# EAGLE design CR Weather (EAGLE 9.6.2)
CNAME: CR Weather Station; CREVISION: 0.1; DESIGNER: crundberg
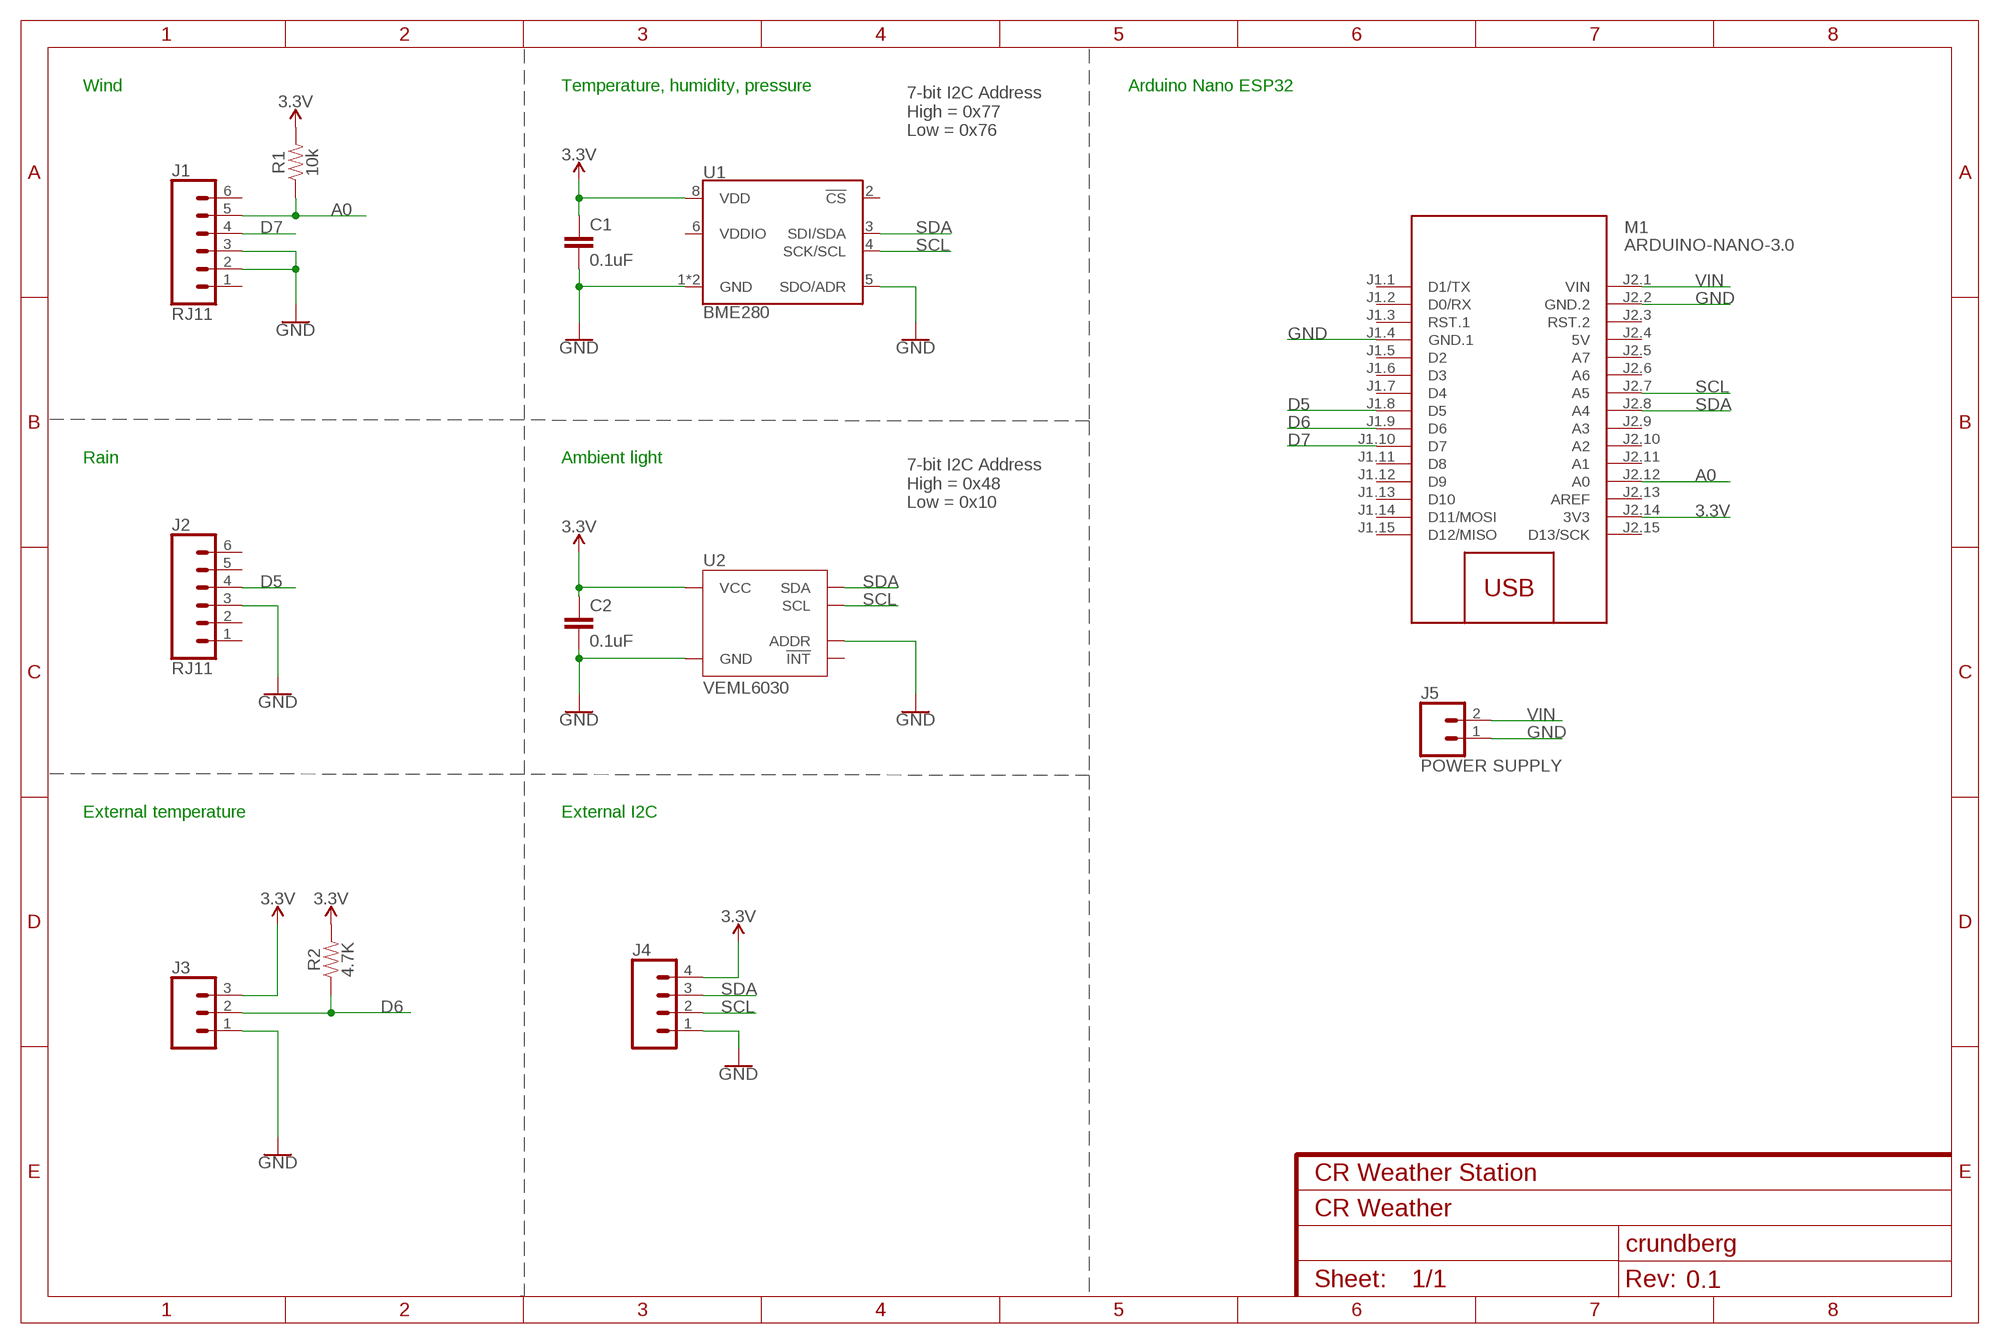
[diagram p0: schematic, sheet 1]

## Parts
C1  0.1uF  0.1UF-0402-6.3V-10%-X7R  [0402]
C2  0.1uF  0.1UF-0402-6.3V-10%-X7R  [0402]
J1  RJ11  RJ11-6  [RJ11-6]
J2  RJ11  RJ11-6  [RJ11-6]
J3  CONN_03SCREW  [SCREWTERMINAL-3.5MM-3]
J4  CONN_04SCREW  [SCREWTERMINAL-3.5MM-4]
J5  POWER SUPPLY  CONN_023.5MM  [SCREWTERMINAL-3.5MM-2]
M1  ARDUINO-NANO-3.0  [ARDUINO-NANO-3.0]
R1  10k  RESISTOR1206  [1206]
R2  4.7K  RESISTOR1206  [1206]
U1  BME280  [LGA-8-2.5X2.5]
U2  VEML6030  [VEML6030]

## Nets
3.3V: C1.1 C2.1 J3.3 J4.4 M1.J2.14(3V3) R1.2 R2.2 U1.8(VDD) U2.6(VCC)
A0: J1.5 M1.J2.12(A0) R1.1
D5: J2.4 M1.J1.8(D5)
D6: J3.2 M1.J1.9(D6) R2.1
D7: J1.4 M1.J1.10(D7)
GND: C1.2 C2.2 J1.2 J1.3 J2.3 J3.1 J4.1 J5.1 M1.J1.4(GND.1) M1.J2.2(GND.2) U1.1(GND) U1.5(SDO/ADR) U1.7(GND) U2.1(GND) U2.4(ADDR)
SCL: J4.2 M1.J2.7(A5) U1.4(SCK/SCL) U2.5(SCL)
SDA: J4.3 M1.J2.8(A4) U1.3(SDI/SDA) U2.2(SDA)
VIN: J5.2 M1.J2.1(VIN)
Unconnected: J1.1 J1.6 J2.1 J2.2 J2.5 J2.6 M1.J1.1(D1/TX) M1.J1.2(D0/RX) M1.J1.3(RST.1) M1.J1.5(D2) M1.J1.6(D3) M1.J1.7(D4) M1.J1.11(D8) M1.J1.12(D9) M1.J1.13(D10) M1.J1.14(D11/MOSI) M1.J1.15(D12/MISO) M1.J2.3(RST.2) M1.J2.5(A7) M1.J2.6(A6) M1.J2.9(A3) M1.J2.10(A2) M1.J2.11(A1) M1.J2.13(AREF) M1.J2.15(D13/SCK) U1.2(!CS) U1.6(VDDIO) U2.3(!INT)

## Notes on the sheet
- Wind | Temperature, humidity, pressure | Arduino Nano ESP32
- 7-bit I2C Address
  High = 0x77
  Low = 0x76
- Rain | Ambient light
- 7-bit I2C Address
  High = 0x48
  Low = 0x10
- External temperature | External I2C

## Power pins joined to a net without a drawn wire
5V: M1.J2.4(5V)

## Library data of the parts
C1 C2 = SparkFun-Capacitors:0.1UF: 0.1µF ceramic capacitors A capacitor is a passive two-terminal electrical component used to store electrical energy temporarily in an electric field.; PROD_ID: CAP-14993
J1 J2 = SparkFun-Connectors:RJ11-6: RJ11 Jack - 6 pin Commonly found on CAT3 devices and some Microchip programmers. Here is the connector we sell at SparkFun: RJ11 6-Pin Connector <https://www.sparkfun.com/products/132> (PRT-00132) Datasheet <http://www.sparkfun.com/datasheets/Prototyping/Connectors/RJ11-Datasheet.pdf> It is used on this SparkFun product: SparkFun Weather Shield <https://www.sparkfun.com/products/12081> (DEV-12081) Weather Meters <https://www.sparkfun.com/products/8942> (SEN-08942); PROD_ID: CONN-08590; SF_ID: PRT-00132
J3 = SparkFun-Connectors:CONN_03: Multi connection point. Often used as Generic Header-pin footprint for 0.1 inch spaced/style header connections On any of the 0.1 inch spaced packages, you can populate with these: Break Away Headers - Straight <https://www.sparkfun.com/products/116> (PRT-00116) Break Away Male Headers - Right Angle <https://www.sparkfun.com/products/553> (PRT-00553) Female Headers <https://www.sparkfun.com/products/115> (PRT-00115) Break Away Headers - Machine Pin <https://www.sparkfun.com/products/117> (PRT-00117) Break Away Female Headers - Swiss Machine Pin <https://www.sparkfun.com/products/743> (PRT-00743) Stackable Header - 3 Pin (Female, 0.1") <https://www.sparkfun.com/products/13875> (PRT-13875) For SCREWTERMINALS and SPRING TERMINALS visit here: Screw Terimnals on SparkFun.com <https://www.sparkfun.com/search/results?term=Screw+Terminals> (5mm/3.5mm/2.54mm spacing) This device is also useful as a general connection point to wire up your design to another part of your project. Our various solder wires solder well into these plated through hole pads. Hook-Up Wire - Assortment (Stranded, 22 AWG) <https://www.sparkfun.com/products/11375> (PRT-11375) Hook-Up Wire - Assortment (Solid Core, 22 AWG) <https://www.sparkfun.com/products/11367> (PRT-11367) View the entire wire category on our website here <https://www.sparkfun.com/categories/141> Special notes: Molex polarized connector foot print use with SKU : PRT-08232 with associated crimp pins and housings.; PROD_ID: CONN-08288; SF_ID: PRT-08235
J4 = SparkFun-Connectors:CONN_04: Multi connection point. Often used as Generic Header-pin footprint for 0.1 inch spaced/style header connections On any of the 0.1 inch spaced packages, you can populate with these: Break Away Headers - Straight <https://www.sparkfun.com/products/116> (PRT-00116) Break Away Male Headers - Right Angle <https://www.sparkfun.com/products/553> (PRT-00553) Female Headers <https://www.sparkfun.com/products/115> (PRT-00115) Break Away Headers - Machine Pin <https://www.sparkfun.com/products/117> (PRT-00117) Break Away Female Headers - Swiss Machine Pin <https://www.sparkfun.com/products/743> (PRT-00743) For SCREWTERMINALS and SPRING TERMINALS visit here: Screw Terimnals on SparkFun.com <https://www.sparkfun.com/search/results?term=Screw+Terminals> (5mm/3.5mm/2.54mm spacing) This device is also useful as a general connection point to wire up your design to another part of your project. Our various solder wires solder well into these plated through hole pads. Hook-Up Wire - Assortment (Stranded, 22 AWG) <https://www.sparkfun.com/products/11375> (PRT-11375) Hook-Up Wire - Assortment (Solid Core, 22 AWG) <https://www.sparkfun.com/products/11367> (PRT-11367) View the entire wire category on our website here <https://www.sparkfun.com/categories/141> Special notes: Molex polarized connector foot print use with SKU : PRT-08231 with associated crimp pins and housings. 1MM SMD Version SKU: PRT-10208; PROD_ID: CONN-14485
J5 = SparkFun-Connectors:CONN_02: Multi connection point. Often used as Generic Header-pin footprint for 0.1 inch spaced/style header connections On any of the 0.1 inch spaced packages, you can populate with these: Break Away Headers - Straight <https://www.sparkfun.com/products/116> (PRT-00116) Break Away Male Headers - Right Angle <https://www.sparkfun.com/products/553> (PRT-00553) Female Headers <https://www.sparkfun.com/products/115> (PRT-00115) Break Away Headers - Machine Pin <https://www.sparkfun.com/products/117> (PRT-00117) Break Away Female Headers - Swiss Machine Pin <https://www.sparkfun.com/products/743> (PRT-00743) For SCREWTERMINALS and SPRING TERMINALS visit here: Screw Terimnals on SparkFun.com <https://www.sparkfun.com/search/results?term=Screw+Terminals> (5mm/3.5mm/2.54mm spacing) This device is also useful as a general connection point to wire up your design to another part of your project. Our various solder wires solder well into these plated through hole pads. Hook-Up Wire - Assortment (Stranded, 22 AWG) <https://www.sparkfun.com/products/11375> (PRT-11375) Hook-Up Wire - Assortment (Solid Core, 22 AWG) <https://www.sparkfun.com/products/11367> (PRT-11367) View the entire wire category on our website here <https://www.sparkfun.com/categories/141> Special notes: Molex polarized connector foot print use with: PRT-08233 with associated crimp pins and housings. 2.54_SCREWTERM for use with PRT-10571. 3.5mm Screw Terminal footprints for PRT-08084 5mm Screw Terminal footprints for use with PRT-08432; PROD_ID: CONN-08399
M1 = diy-modules:ARDUINO-NANO-3.0: Arduino Nano 3.0 and compatible devices More details available here: https://www.arduino.cc/en/Main/ArduinoBoardNano Click here to find device on ebay.com <http://www.ebay.com/sch/arduino+nano>
R1 R2 = SparkFun-Resistors:RESISTOR: Generic Resistor Package
U1 = SparkFun-Sensors:BME280: Bosch BME280 – Combined Humidity and Pressure Sensor The BME280 is as combined digital humidity, pressure and temperature sensor based on proven sensing principles. The sensor module is housed in an extremely compact metal-lid LGA package with a footprint of only 2.5×2.5mm² with a height of 0.93mm. Its small dimensions and its low power consumption allow the implementation in battery driven devices such as handsets, GPS modules or watches. Datasheet <https://cdn.sparkfun.com/assets/learn_tutorials/4/1/9/BST-BME280_DS001-10.pdf> SparkFun Products SparkFun Atmospheric Sensor Breakout - BME280 <https://www.sparkfun.com/products/13676> (SEN-13676); PROD_ID: IC-13090
U2 = SparkFun-Sensors:VEML6030: VEML6030 Ambient Light Sensor VEML6030 is a high accuracy ambient light digital 16-bit resolution sensor in a miniature transparent 2 mm x 2 mm package. It includes a high sensitive photodiode, a low noise amplifier, a 16-bit A/D converter and supports an easy to use I2C bus communication interface and additional interrupt feature.; PROD_ID: IC-14447

## Board
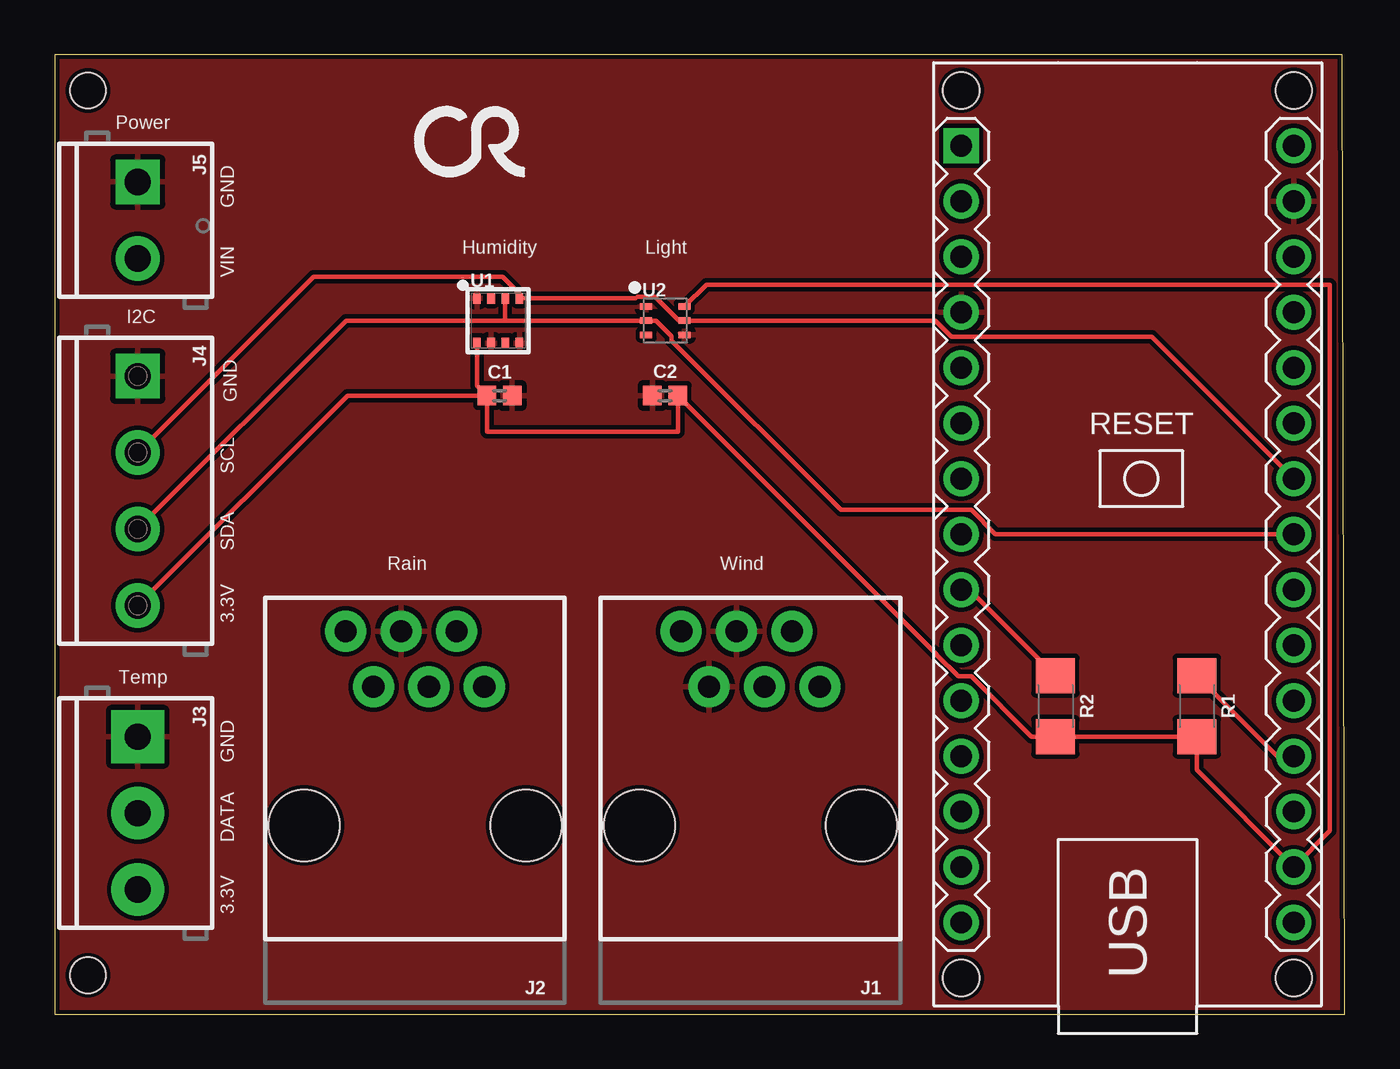
[diagram p1: board, top side]
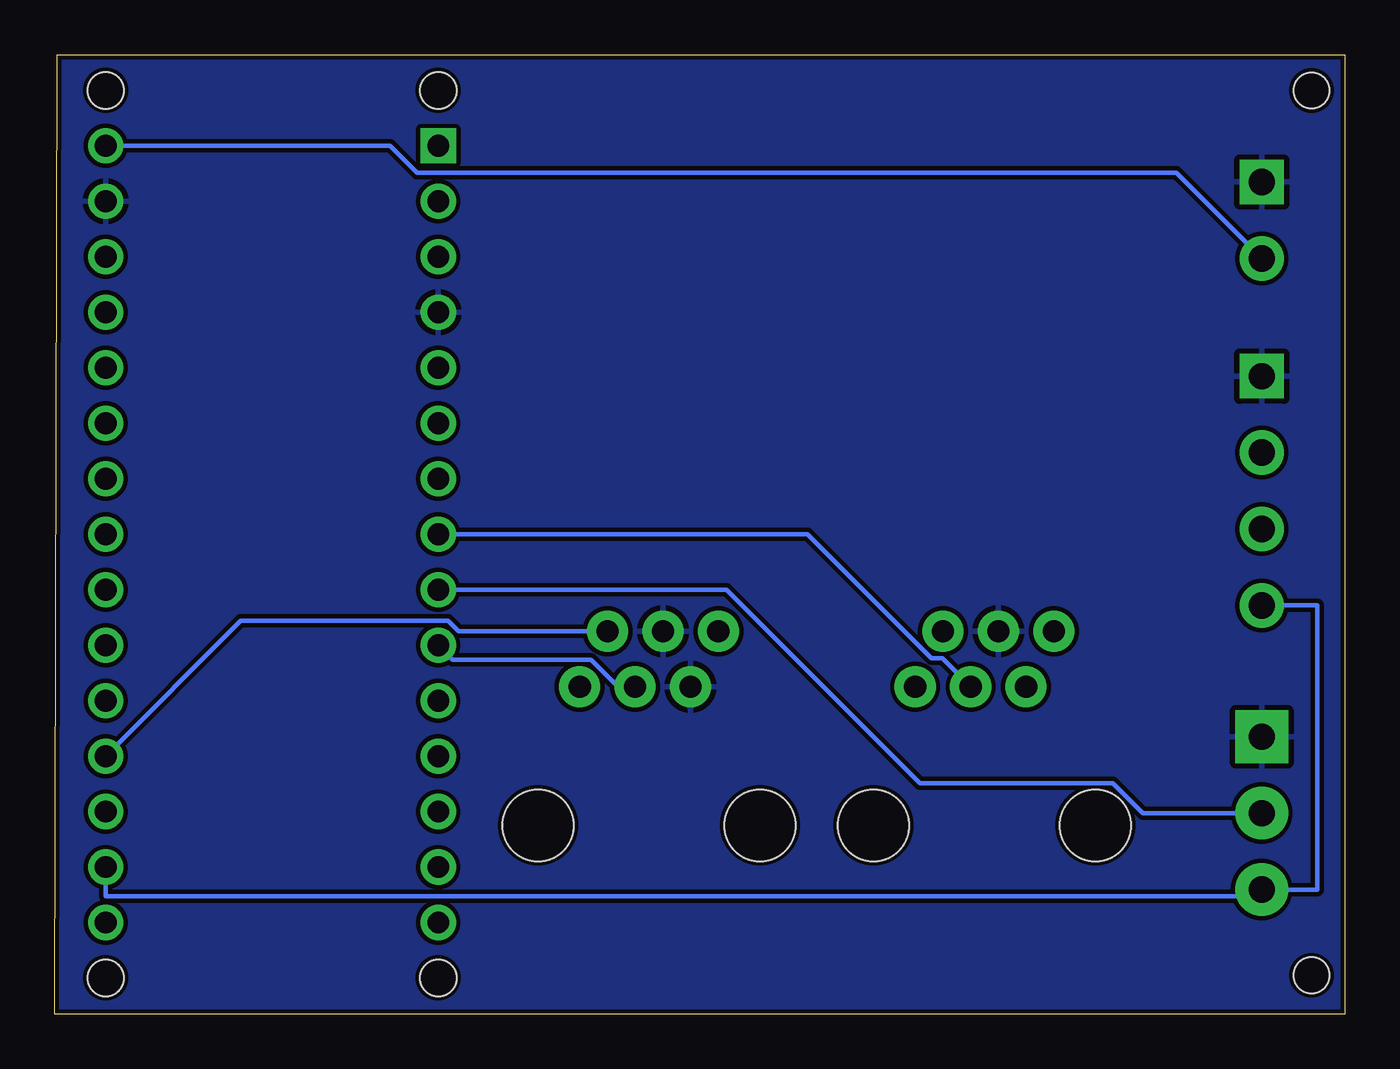
[diagram p2: board, bottom side, seen from below]

Size 59.11 x 43.93 mm. Coordinates in mm from the lower left corner, seen from the top.
Outline: 0,0 59.11,0 58.98,43.93 0,43.93 0,0
Copper layers (1*16): Top 0.035mm / dielectric 1.5mm / Bottom 0.035mm
Design rules "SparkFun": minimum track width 8mil, minimum drill 20mil, track to track 8mil, track to pad 8mil, pad to pad 8mil, via to via 8mil, smd to smd 8mil, copper to edge 8mil, drill to drill 8mil, minimum pad ring 12mil, minimum via ring 10mil, stop-mask expansion 4mil, vias tented up to drill 20mil, thermal gap 10mil
Holes 1.63 mm at 1.52,42.29 1.52,1.78

### Footprints (pad centres in the part's own frame; a part is rotated, then mirrored left to right if it is on the bottom)
0402 = smd 0.85 x 0.9: 1 -0.58,0; 2 0.58,0
RJ11-6 = drill 1.016 pad 1.88: 1 -3.175,8.89; 2 -1.905,6.35; 3 -0.635,8.89; 4 0.635,6.35; 5 1.905,8.89; 6 3.175,6.35 | hole 3.251: -5.08,0; 5.08,0
SCREWTERMINAL-3.5MM-3 = drill 1.2 pad 2.413 square: 1 0,0 | drill 1.2 pad 2.413: 2 3.5,0; 3 7,0
SCREWTERMINAL-3.5MM-4 = drill 1.2 pad 2.032 square: 1 0,0 | drill 1.2 pad 2.032: 2 3.5,0; 3 7,0; 4 10.5,0
SCREWTERMINAL-3.5MM-2 = drill 1.2 pad 2.032 square: 1 0,0 | drill 1.2 pad 2.032: 2 3.5,0
ARDUINO-NANO-3.0 = drill 1 square: J1.1 17.78,7.62 | drill 1: J1.2 15.24,7.62; J1.3 12.7,7.62; J1.4 10.16,7.62; J1.5 7.62,7.62; J1.6 5.08,7.62; J1.7 2.54,7.62; J1.8 0,7.62; J1.9 -2.54,7.62; J1.10 -5.08,7.62; J1.11 -7.62,7.62; J1.12 -10.16,7.62; J1.13 -12.7,7.62; J1.14 -15.24,7.62; J1.15 -17.78,7.62; J2.1 17.78,-7.62; J2.2 15.24,-7.62; J2.3 12.7,-7.62; J2.4 10.16,-7.62; J2.5 7.62,-7.62; J2.6 5.08,-7.62; J2.7 2.54,-7.62; J2.8 0,-7.62; J2.9 -2.54,-7.62; J2.10 -5.08,-7.62; J2.11 -7.62,-7.62; J2.12 -10.16,-7.62; J2.13 -12.7,-7.62; J2.14 -15.24,-7.62; J2.15 -17.78,-7.62 | hole 1.651: -20.32,7.62; -20.32,-7.62; 20.32,-7.62; 20.32,7.62
1206 = smd 1.6 x 1.8: 1 -1.4,0; 2 1.4,0
LGA-8-2.5X2.5 = smd 0.35 x 0.5: 1 -0.975,1.025; 2 -0.325,1.025; 3 0.325,1.025; 4 0.975,1.025; 5 0.975,-1.025; 6 0.325,-1.025; 7 -0.325,-1.025; 8 -0.975,-1.025
VEML6030 = smd 0.55 x 0.3: 1 -0.88,0.65; 2 -0.88,0; 3 -0.88,-0.65; 4 0.87,-0.65; 5 0.87,0; 6 0.87,0.65

### Placement (x,y rotation side)
C1  20.38,28.32 0 top
C2  27.97,28.32 180 top
J1  31.88,8.64 0 top
J2  16.51,8.64 0 top
J3  3.81,12.7 270 top
J4  3.81,29.21 270 top
J5  3.81,38.1 270 top
M1  49.15,21.97 90 top
R1  52.32,14.1 270 top
R2  45.85,14.1 270 top
U1  20.32,31.75 0 top
U2  27.98,31.75 0 top
U$1  [CRLOGO_05MM_TEXT]  16.51,38.35 0 top

### Tracks (layer width: path | path; a pad name or v marks a point on that pad's centre or on a via)
3.3V
  Top 0.203: J4.4 13.42,28.32 C1.1 | C1.1 19.34,28.78 U1.8 | C1.1 19.8,26.67 28.55,26.67 C2.1 40.42,16.45 40.42,16.43 41.39,15.46 41.99,15.46 44.75,12.7 R2.2 R1.2 52.32,11.18 M1.J2.14 58.42,8.38 58.42,33.4 29.85,33.4 U2.6
  Bottom 0.203: J4.4 1.27,18.71 1.27,5.7 J3.3 3.81,5.4 56.77,5.4 M1.J2.14
A0
  Top 0.203: M1.J2.12 56.01,11.81 R1.1
  Bottom 0.203: J1.5 40.59,17.53 41.07,18 50.58,18 M1.J2.12
D5
  Bottom 0.203: J2.4 18.44,16.28 18.93,16.28 24.62,21.97 M1.J1.8
D6
  Top 0.203: R2.1 41.91,19.43 M1.J1.9
  Bottom 0.203: J3.2 9.26,9.2 10.63,10.57 19.46,10.57 28.32,19.43 M1.J1.9
D7
  Bottom 0.203: J1.4 33.29,14.99 34.54,16.23 40.87,16.23 M1.J1.10
GND
  pour Top: 0,43.93 0,0 59.11,0 58.98,43.93
  pour Bottom: 0,43.93 0,0 59.11,0 58.98,43.93
SCL
  Top 0.203: J4.2 11.86,33.76 20.51,33.76 21.29,32.98 U1.4 26.62,32.77 26.7,32.85 27.5,32.85 28.61,31.75 U2.5 40.34,31.75 41.07,31.02 50.26,31.02 M1.J2.7
SDA
  Top 0.203: 20.64,31.75 U2.2 27.55,31.75 28.27,31.02 28.27,30.82 36.01,23.08 41.99,23.08 43.1,21.97 M1.J2.8 | 20.64,31.75 U1.3 | 20.64,31.75 13.35,31.75 J4.3
VIN
  Bottom 0.203: M1.J2.1 43.74,39.75 42.51,38.51 7.72,38.51 J5.2

### Text on the board
tPlace: Power | GND | VIN | Humidity | Light | I2C | GND | SCL | SDA | Rain | Wind | 3.3V | Temp | GND | DATA | 3.3V